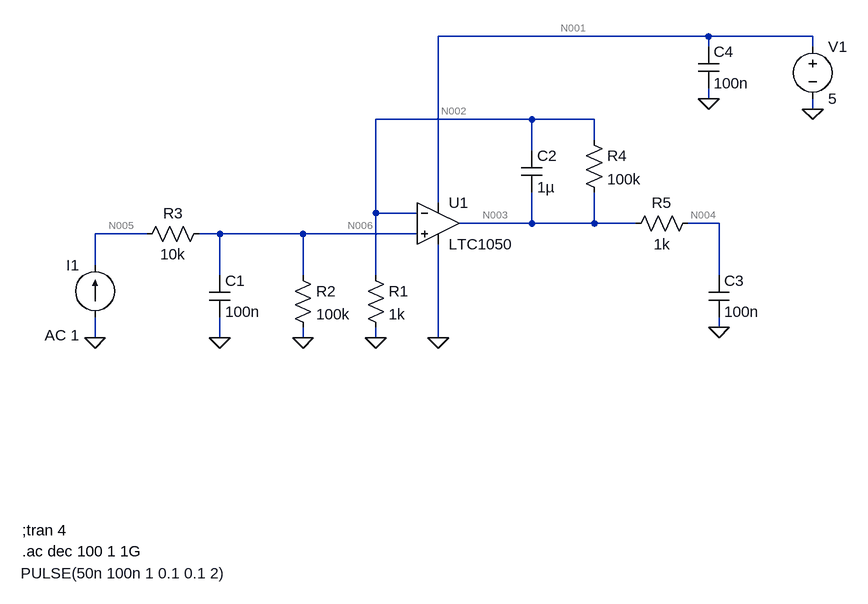
[diagram p0: schematic Draft1.asc]
Draft1.asc, the LTspice schematic file:
Version 4
SHEET 1 880 684
WIRE 576 -160 160 -160
WIRE 736 -160 576 -160
WIRE 576 -144 576 -160
WIRE 736 -144 736 -160
WIRE 576 -64 576 -80
WIRE 736 -48 736 -64
WIRE 304 -32 64 -32
WIRE 400 -32 304 -32
WIRE 400 0 400 -32
WIRE 304 16 304 -32
WIRE 160 96 160 -160
WIRE 64 112 64 -32
WIRE 128 112 64 112
WIRE 304 128 304 80
WIRE 304 128 192 128
WIRE 400 128 400 80
WIRE 400 128 304 128
WIRE 464 128 400 128
WIRE 592 128 544 128
WIRE -288 144 -368 144
WIRE -176 144 -208 144
WIRE -48 144 -176 144
WIRE 128 144 -48 144
WIRE -368 192 -368 144
WIRE -176 208 -176 144
WIRE -48 208 -48 144
WIRE 64 208 64 112
WIRE 592 208 592 128
WIRE 592 288 592 272
WIRE -368 304 -368 272
WIRE -176 304 -176 272
WIRE -48 304 -48 288
WIRE 64 304 64 288
WIRE 160 304 160 160
FLAG 576 -64 0
FLAG 592 288 0
FLAG 64 304 0
FLAG -48 304 0
FLAG -176 304 0
FLAG -368 304 0
FLAG 736 -48 0
FLAG 160 304 0
SYMBOL OpAmps\\LTC1050 160 64 R0
SYMATTR InstName U1
SYMBOL res 48 192 R0
SYMATTR InstName R1
SYMATTR Value 1k
SYMBOL res -64 192 R0
SYMATTR InstName R2
SYMATTR Value 100k
SYMBOL cap -192 208 R0
SYMATTR InstName C1
SYMATTR Value 100n
SYMBOL res -192 128 R90
WINDOW 0 0 56 VBottom 2
WINDOW 3 32 56 VTop 2
SYMATTR InstName R3
SYMATTR Value 10k
SYMBOL cap 288 16 R0
SYMATTR InstName C2
SYMATTR Value 1µ
SYMBOL res 384 -16 R0
SYMATTR InstName R4
SYMATTR Value 100k
SYMBOL res 560 112 R90
WINDOW 0 0 56 VBottom 2
WINDOW 3 32 56 VTop 2
SYMATTR InstName R5
SYMATTR Value 1k
SYMBOL cap 576 208 R0
SYMATTR InstName C3
SYMATTR Value 100n
SYMBOL cap 560 -144 R0
SYMATTR InstName C4
SYMATTR Value 100n
SYMBOL current -368 272 R180
WINDOW 0 24 80 Left 2
WINDOW 3 -203 -394 Left 2
WINDOW 123 24 -28 Left 2
WINDOW 39 0 0 Left 0
SYMATTR InstName I1
SYMATTR Value PULSE(50n 100n 1 0.1 0.1 2)
SYMATTR Value2 AC 1
SYMBOL voltage 736 -160 R0
WINDOW 123 0 0 Left 0
WINDOW 39 0 0 Left 0
SYMATTR InstName V1
SYMATTR Value 5
TEXT -480 600 Left 2 !;tran 4
TEXT -480 632 Left 2 !.ac dec 100 1 1G

The netlist it stands for:
* Draft1.asc
XU1 N006 N002 N001 0 N003 LTC1050  ; pins In+ In- V+ V- OUT
R1 N002 0 1k
R2 N006 0 100k
C1 N006 0 100n
R3 N006 N005 10k
C2 N002 N003 1µ
R4 N002 N003 100k
R5 N004 N003 1k
C3 N004 0 100n
C4 N001 0 100n
I1 0 N005 PULSE(50n 100n 1 0.1 0.1 2) AC 1
V1 N001 0 5
;tran 4
.ac dec 100 1 1G
.lib LTC.lib
.backanno
.end

* Results of the author's LTspice run, read from the files saved beside the schematic
* Operating Point, zero values left out:
*   V(n002) = 5 mV
*   V(n006) = 5 mV
*   V(n001) = 5 V
*   V(n003) = 505 mV
*   V(n005) = 5.5 mV
*   V(n004) = 505 mV
*   I(I1) = 50 nA
*   I(R4) = -5 µA
*   I(R3) = -50 nA
*   I(R2) = 50 nA
*   I(R1) = 5 µA
*   I(V1) = -754.1 µA
*   Ix(u1:3) = 754.1 µA
*   Ix(u1:4) = -749.1 µA
*   Ix(u1:5) = -5 µA
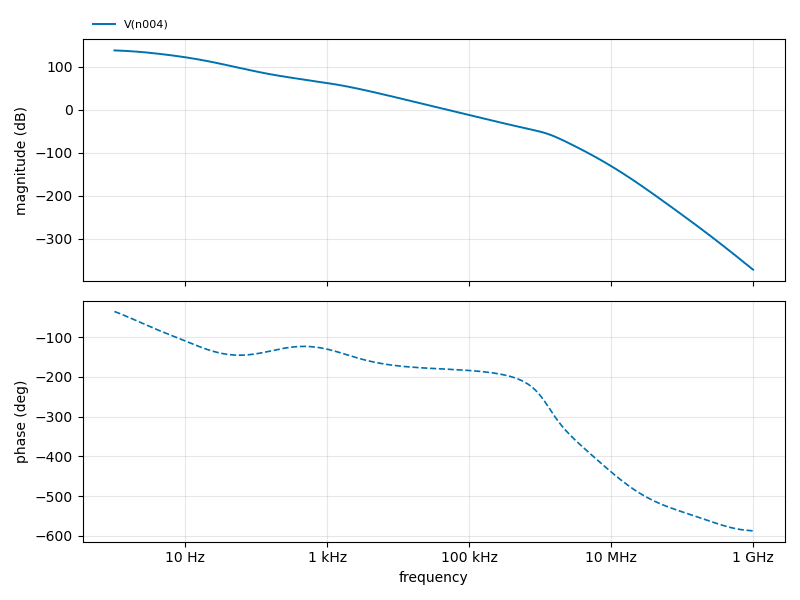
[diagram p1: AC Analysis of Draft1.asc, plotted from the saved traces]
* AC Analysis, 1 run:
*   V(n004): 138.62 dB at 1 Hz, -371.90 dB at 1 GHz, peak 138.62 dB at 1 Hz, 3 dB below the peak at 2.107 Hz